# Altium schematic sheet G1 Bus Breakout.SchDoc: G1 Bus Breakout
size A; DrawnBy: Zeigren; Revision: 2; SheetNumber: 1; SheetTotal: 1
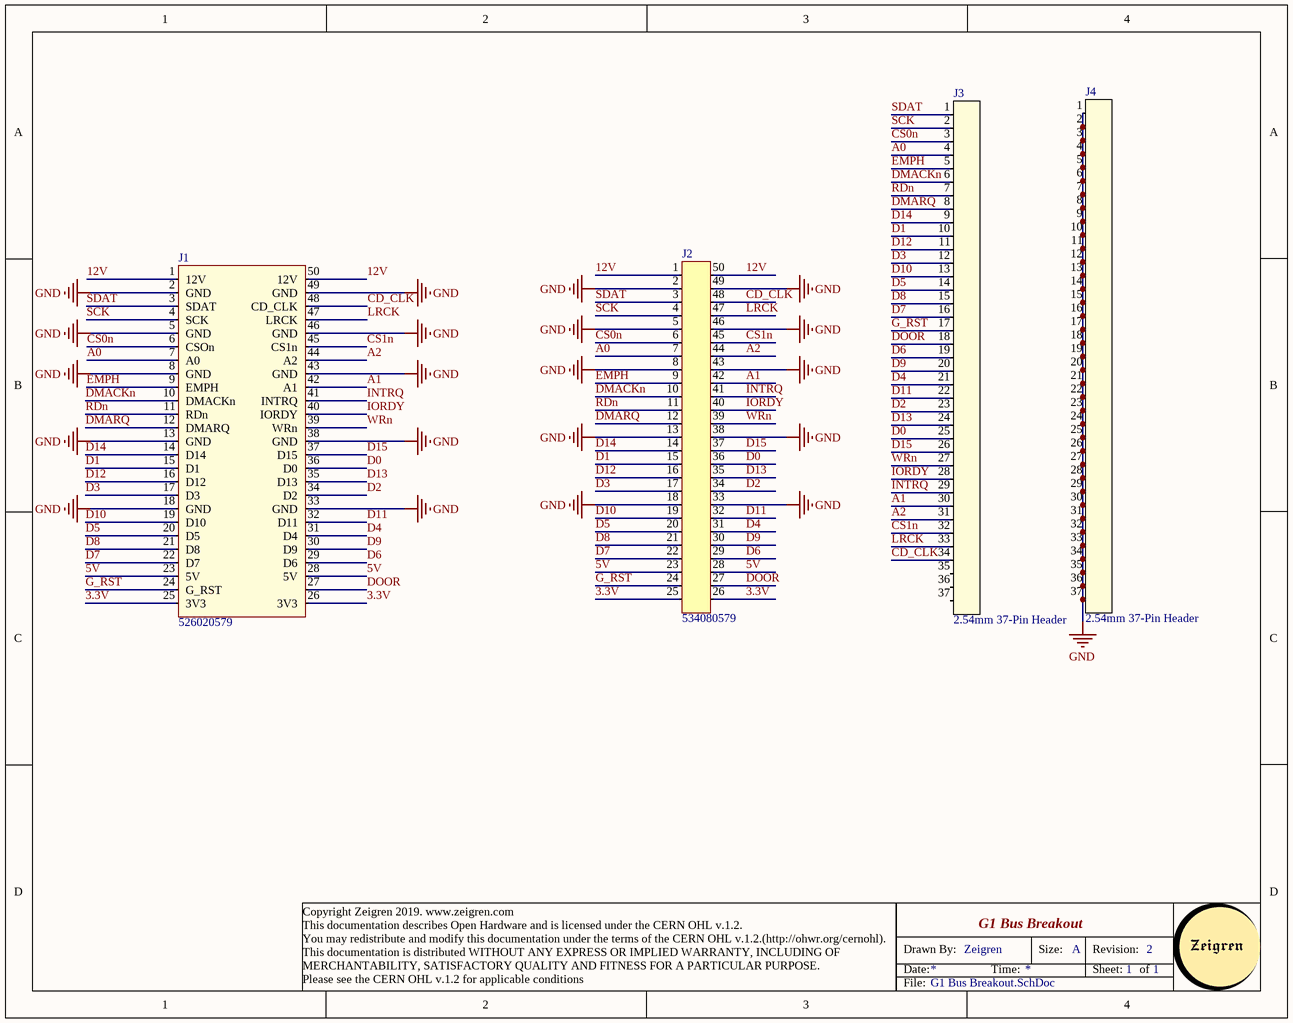
[diagram p0: G1 Bus Breakout.SchDoc]

## Parts
J1  526020579  [GDROMCONN]
J2  534080579  [GDROM Female CONN]
J3  2.54mm 37-Pin Header  [37 Pins]
J4  2.54mm 37-Pin Header  [37 Pins]

## Nets
GND: J1.2(GND) J1.5(GND) J1.8(GND) J1.13(GND) J1.18(GND) J1.33(GND) J1.38(GND) J1.43(GND) J1.46(GND) J1.49(GND) J2.2 J2.5 J2.8 J2.13 J2.18 J2.33 J2.38 J2.43 J2.46 J2.49 J4.1 J4.2 J4.3 J4.4 J4.5 J4.6 J4.7 J4.8 J4.9 J4.10 J4.11 J4.12 J4.13 J4.14 J4.15 J4.16 J4.17 J4.18 J4.19 J4.20 J4.21 J4.22 J4.23 J4.24 J4.25 J4.26 J4.27 J4.28 J4.29 J4.30 J4.31 J4.32 J4.33 J4.34 J4.35 J4.36 J4.37
3.3V: J1.25(3V3) J1.26(3V3) J2.25 J2.26
5V: J1.23(5V) J1.28(5V) J2.23 J2.28
12V: J1.1(12V) J1.50(12V) J2.1 J2.50
A0: J1.7(A0) J2.7 J3.4
A1: J1.42(A1) J2.42 J3.30
A2: J1.44(A2) J2.44 J3.31
CD_CLK: J1.48(CD_CLK) J2.48 J3.34
CS0n: J1.6(CSOn) J2.6 J3.3
CS1n: J1.45(CS1n) J2.45 J3.32
D0: J1.36(D0) J2.36 J3.25
D1: J1.15(D1) J2.15 J3.10
D2: J1.34(D2) J2.34 J3.23
D3: J1.17(D3) J2.17 J3.12
D4: J1.31(D4) J2.31 J3.21
D5: J1.20(D5) J2.20 J3.14
D6: J1.29(D6) J2.29 J3.19
D7: J1.22(D7) J2.22 J3.16
D8: J1.21(D8) J2.21 J3.15
D9: J1.30(D9) J2.30 J3.20
D10: J1.19(D10) J2.19 J3.13
D11: J1.32(D11) J2.32 J3.22
D12: J1.16(D12) J2.16 J3.11
D13: J1.35(D13) J2.35 J3.24
D14: J1.14(D14) J2.14 J3.9
D15: J1.37(D15) J2.37 J3.26
DMACKn: J1.10(DMACKn) J2.10 J3.6
DMARQ: J1.12(DMARQ) J2.12 J3.8
DOOR: J1.27 J2.27 J3.18
EMPH: J1.9(EMPH) J2.9 J3.5
G_RST: J1.24(G_RST) J2.24 J3.17
INTRQ: J1.41(INTRQ) J2.41 J3.29
IORDY: J1.40(IORDY) J2.40 J3.28
LRCK: J1.47(LRCK) J2.47 J3.33
RDn: J1.11(RDn) J2.11 J3.7
SCK: J1.4(SCK) J2.4 J3.2
SDAT: J1.3(SDAT) J2.3 J3.1
WRn: J1.39(WRn) J2.39 J3.27

Not connected (* = marked no-connect by the designer): J3 35 36 37

## Notes on the sheet
- Drawn By:
- Date:
- Time:
- Size:
- A
- Revision:
- Sheet:
- of
- Copyright Zeigren 2019. www.zeigren.com
  This documentation describes Open Hardware and is licensed under the CERN OHL v.1.2.
  You may redistribute and modify this documentation under the terms of the CERN OHL v.1.2.(http://ohwr.org/cernohl).
  This documentation is distributed WITHOUT ANY EXPRESS OR IMPLIED WARRANTY, INCLUDING OF MERCHANTABILITY, SATISFACTORY QUALITY AND FITNESS FOR A PARTICULAR PURPOSE.
  Please see the CERN OHL v.1.2 for applicable conditions
- File:

## Library data of the parts
J1 = GDROM CONN 52602-0579
J2 = GDROM Female Connector